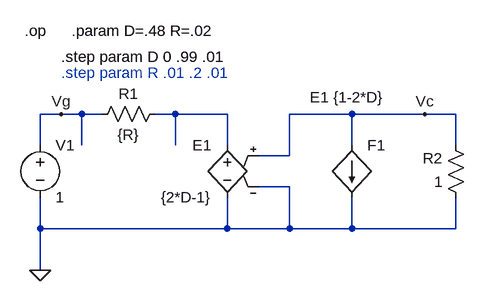
[diagram p0: schematic HBridgeDraf5.asc]
HBridgeDraf5.asc, the LTspice schematic file:
Version 4
SHEET 1 880 680
WIRE 128 128 96 128
WIRE 160 128 128 128
WIRE 192 128 160 128
WIRE 304 128 272 128
WIRE 384 128 304 128
WIRE 576 128 480 128
WIRE 688 128 576 128
WIRE 736 128 688 128
WIRE 96 176 96 128
WIRE 160 176 160 128
WIRE 304 176 304 128
WIRE 384 176 384 128
WIRE 576 176 576 128
WIRE 736 176 736 128
WIRE 480 192 480 128
WIRE 480 192 432 192
WIRE 480 240 432 240
WIRE 96 304 96 256
WIRE 384 304 384 256
WIRE 384 304 96 304
WIRE 480 304 480 240
WIRE 480 304 384 304
WIRE 576 304 576 256
WIRE 576 304 480 304
WIRE 736 304 736 256
WIRE 736 304 576 304
WIRE 96 368 96 304
FLAG 96 368 0
FLAG 128 128 Vg
FLAG 688 128 Vc
SYMBOL voltage 96 160 R0
WINDOW 123 0 0 Left 0
WINDOW 39 0 0 Left 0
SYMATTR InstName V1
SYMATTR Value 1
SYMBOL res 288 112 R90
WINDOW 0 0 56 VBottom 2
WINDOW 3 32 56 VTop 2
SYMATTR InstName R1
SYMATTR Value {R}
SYMBOL res 752 272 R180
WINDOW 0 36 76 Left 2
WINDOW 3 36 40 Left 2
SYMATTR InstName R2
SYMATTR Value 1
SYMBOL e 384 160 M0
SYMATTR InstName E1
SYMATTR Value {2*D-1}
SYMBOL f 576 176 R0
WINDOW 3 -65 -74 Left 2
SYMATTR InstName F1
SYMATTR Value E1 {1-2*D}
TEXT 144 0 Left 2 !.param D=.48 R=.02
TEXT 128 40 Left 2 !.step param D 0 .99 .01
TEXT 72 0 Left 2 !.op
TEXT 128 64 Left 2 ;.step param R .01 .2 .01

The netlist it stands for:
* HBridgeDraf5.asc
V1 Vg 0 1
R1 N001 Vg {R}
R2 0 Vc 1
E1 N001 0 Vc 0 {2*D-1}
F1 Vc 0 E1 {1-2*D}
.param D=.48 R=.02
.step param D 0 .99 .01
.op
* .step param R .01 .2 .01
.backanno
.end

* Results of the author's LTspice run, read from the files saved beside the schematic
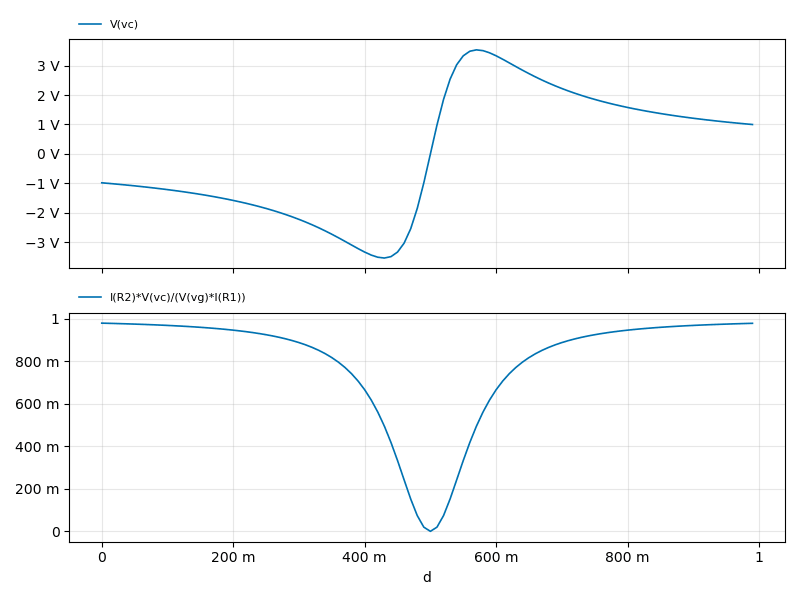
[diagram p1: Operating Point of HBridgeDraf5.asc, plotted from the saved traces]
* Operating Point, 1 run:
*   V(vc): -980.4 mV at d=0, 999.6 mV at d=990 m, min -3.535 V, max 3.535 V
*   I(R2)*V(vc)/(V(vg)*I(R1)): 980.4 m at d=0, 979.6 m at d=990 m, min 0, max 980.4 m